# Altium schematic sheet Main Loom Schematic.SchDoc: MAIN LOOM
size A1; CheckedBy: TIMOTHY WARNOCK; Author: TIMOTHY WARNOCK; CompanyName: CURTIN MOTORSPORT TEAM; DrawnBy: TIMOTHY WARNOCK; Engineer: TIMOTHY WARNOCK; Revision: 2; SheetNumber: 1; SheetTotal: 5; PageSetup: Record=PageOptions|CenterHorizontal=True|CenterVertical=True|PrintScale=1.00|XCorrection=1.00|YCorrection=1.00|PrintKind=1|BorderSize=5000000|LeftOffset=0|BottomOffset=0|Orientation=2|PaperLength=1000|PaperWidth=1000|Scale=100|PaperSource=7|PrintQuality=-3|MediaType=1|DitherType=10|PrintScaleMode=1|PaperKind=A3|PaperIndex=8; ProjectName: 2017 PERMANENT LOOM
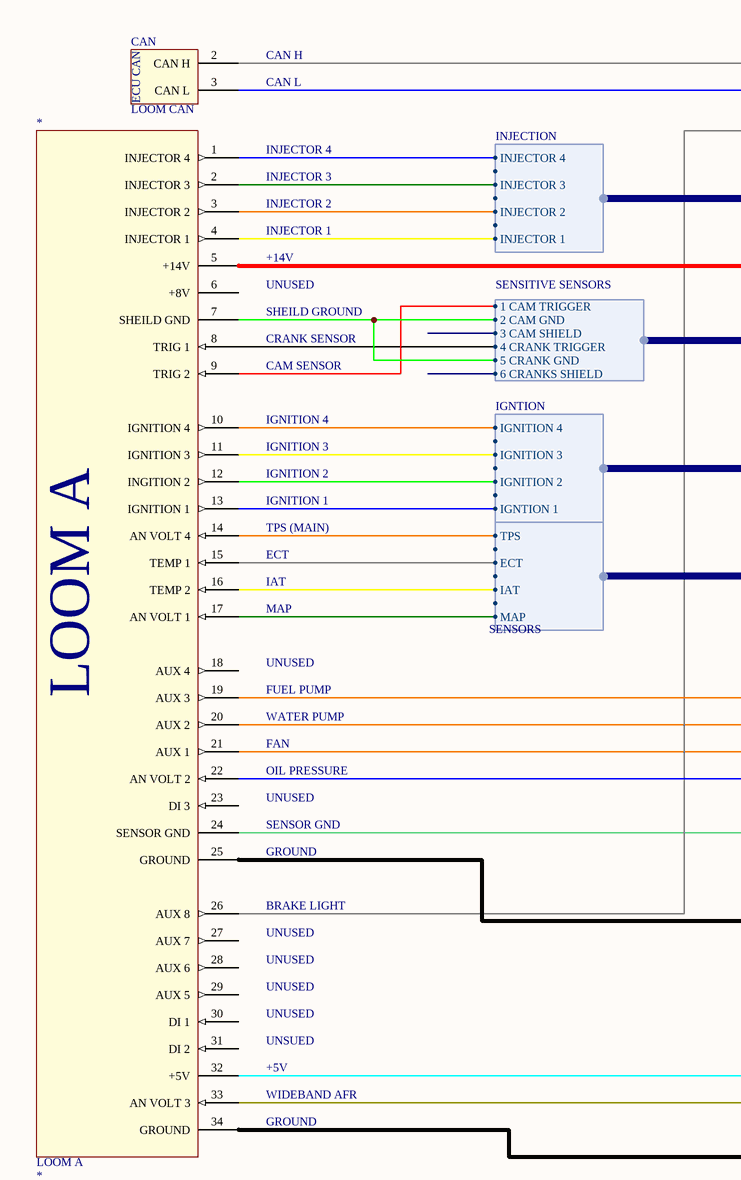
[diagram p0: Main Loom Schematic.SchDoc, top left]
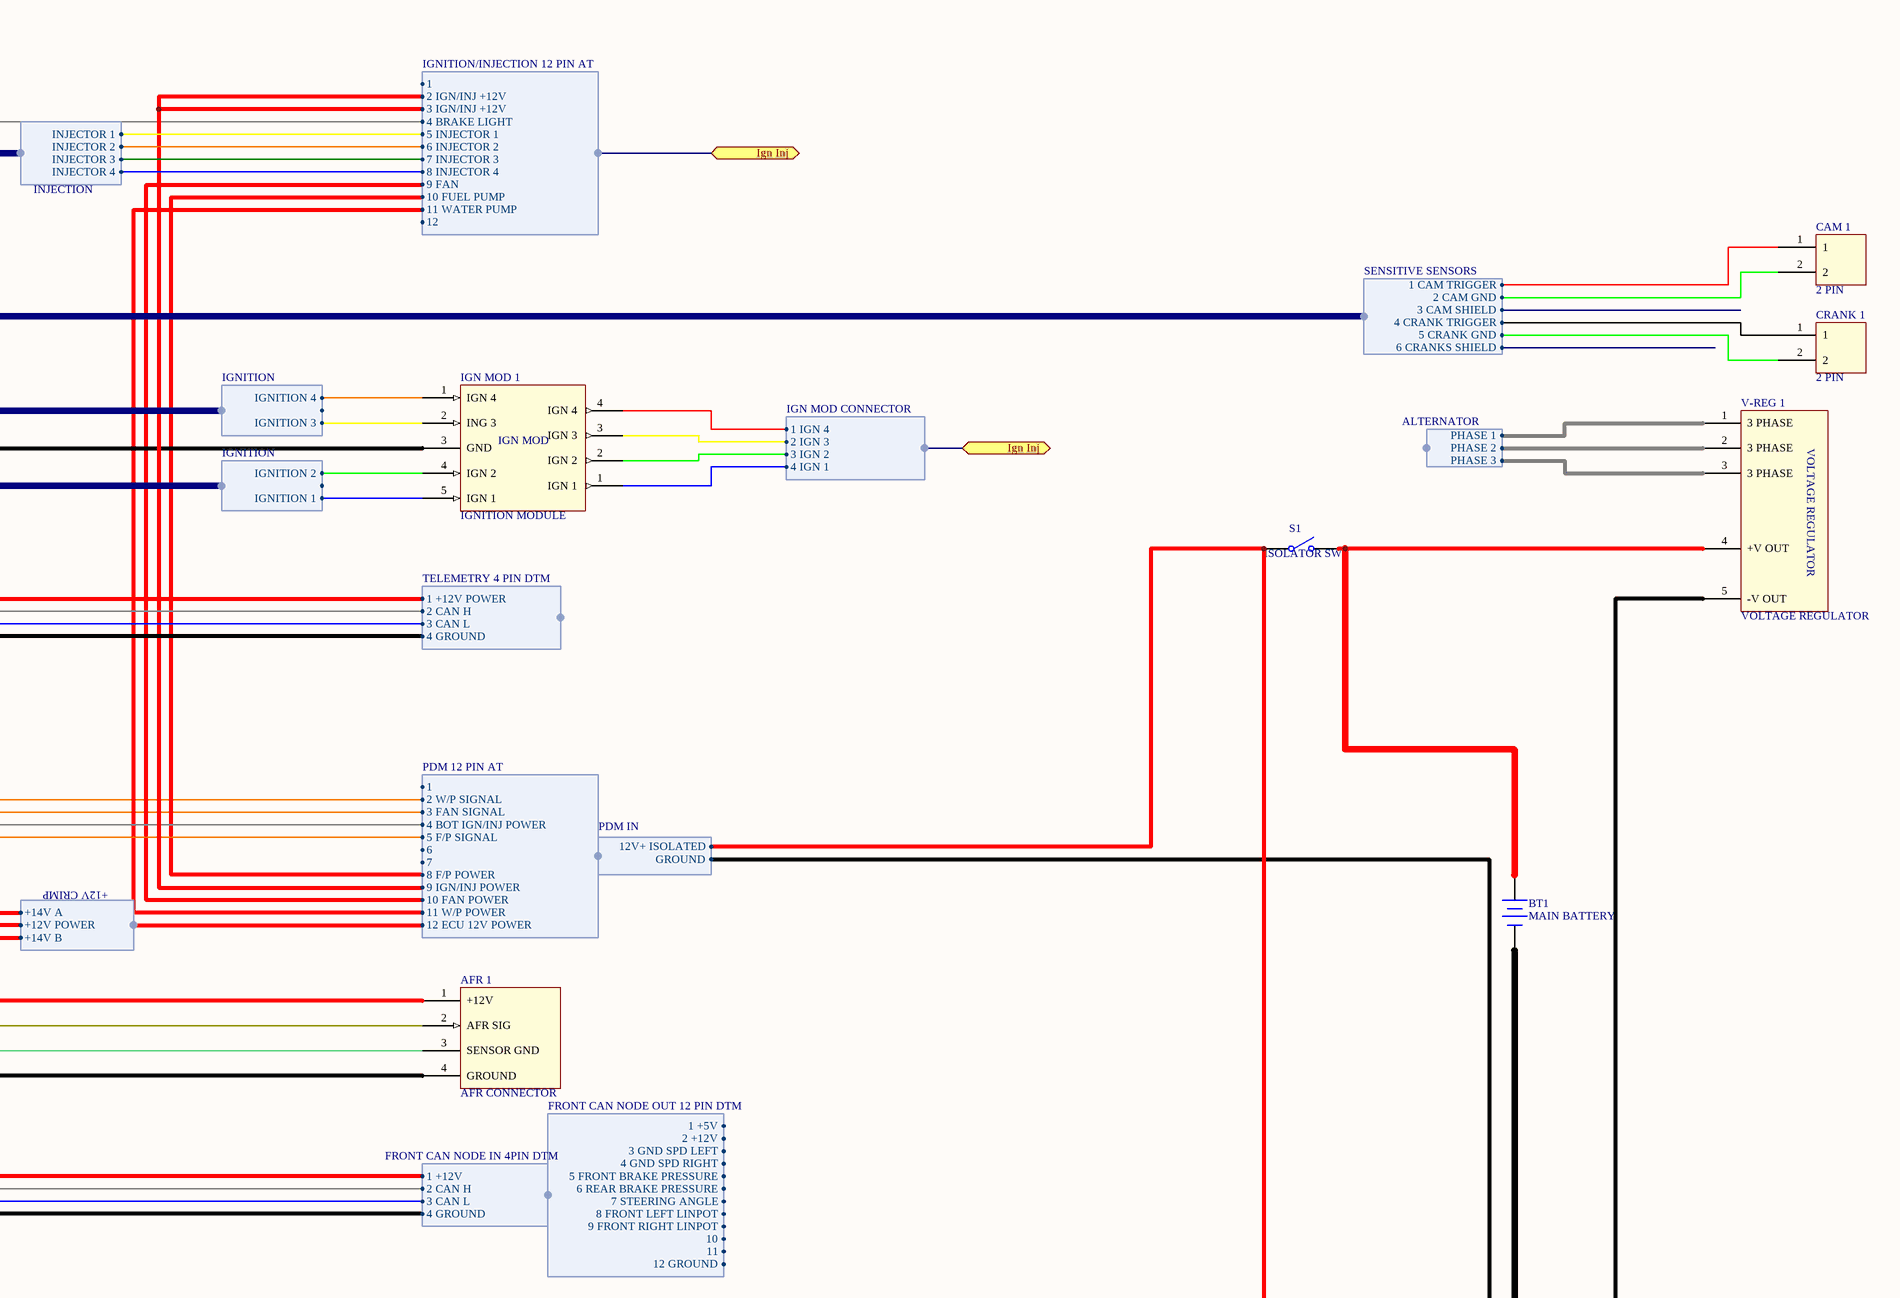
[diagram p1: Main Loom Schematic.SchDoc, top right]
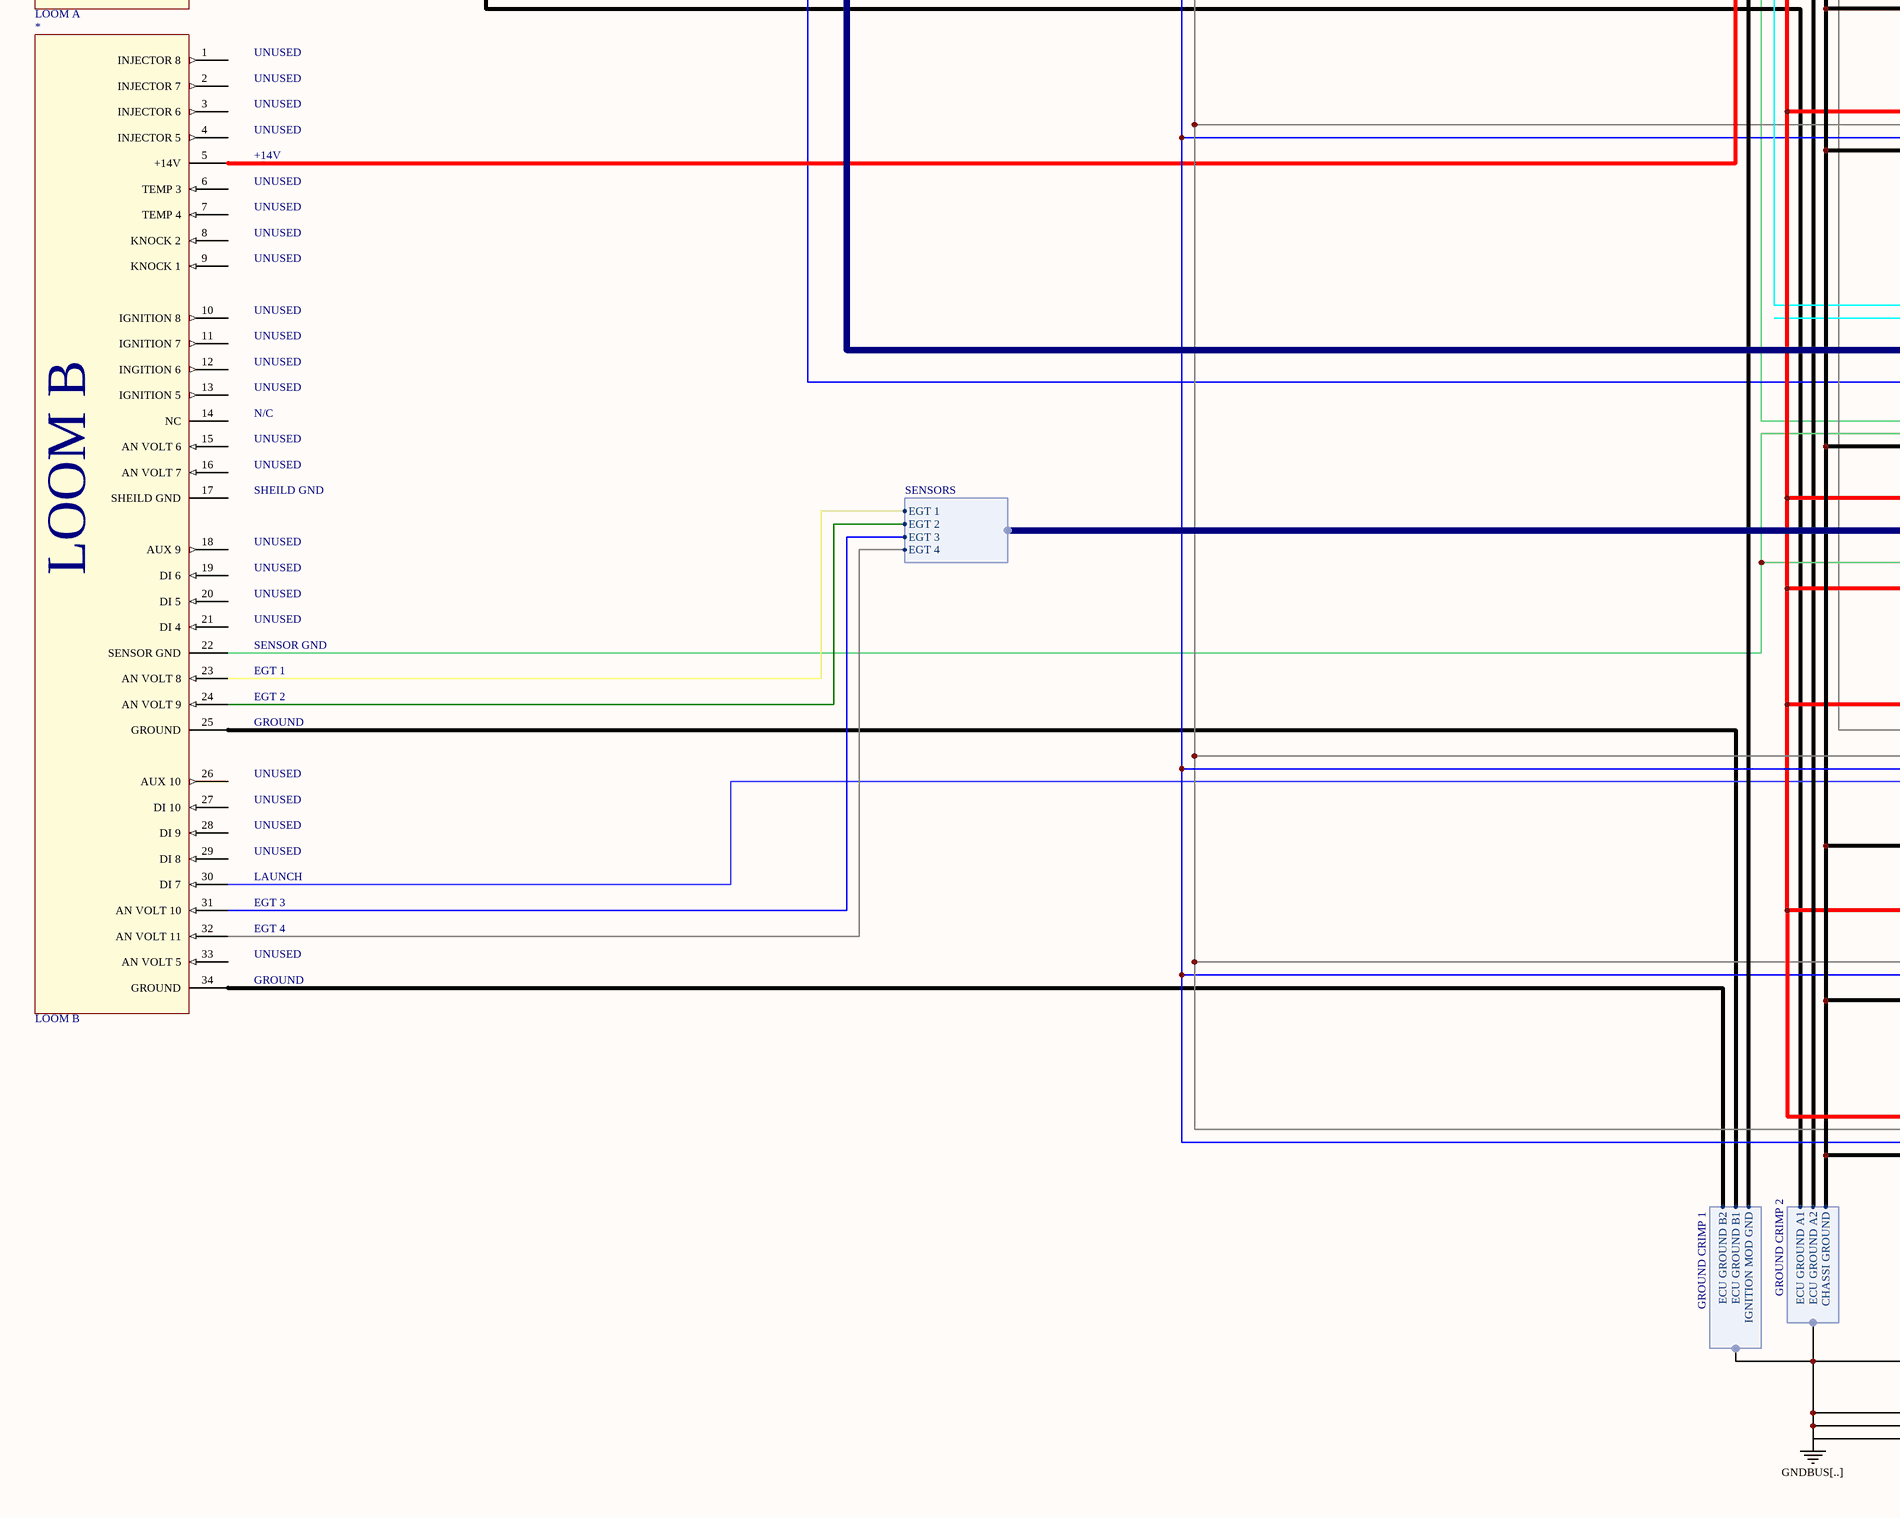
[diagram p2: Main Loom Schematic.SchDoc, bottom left]
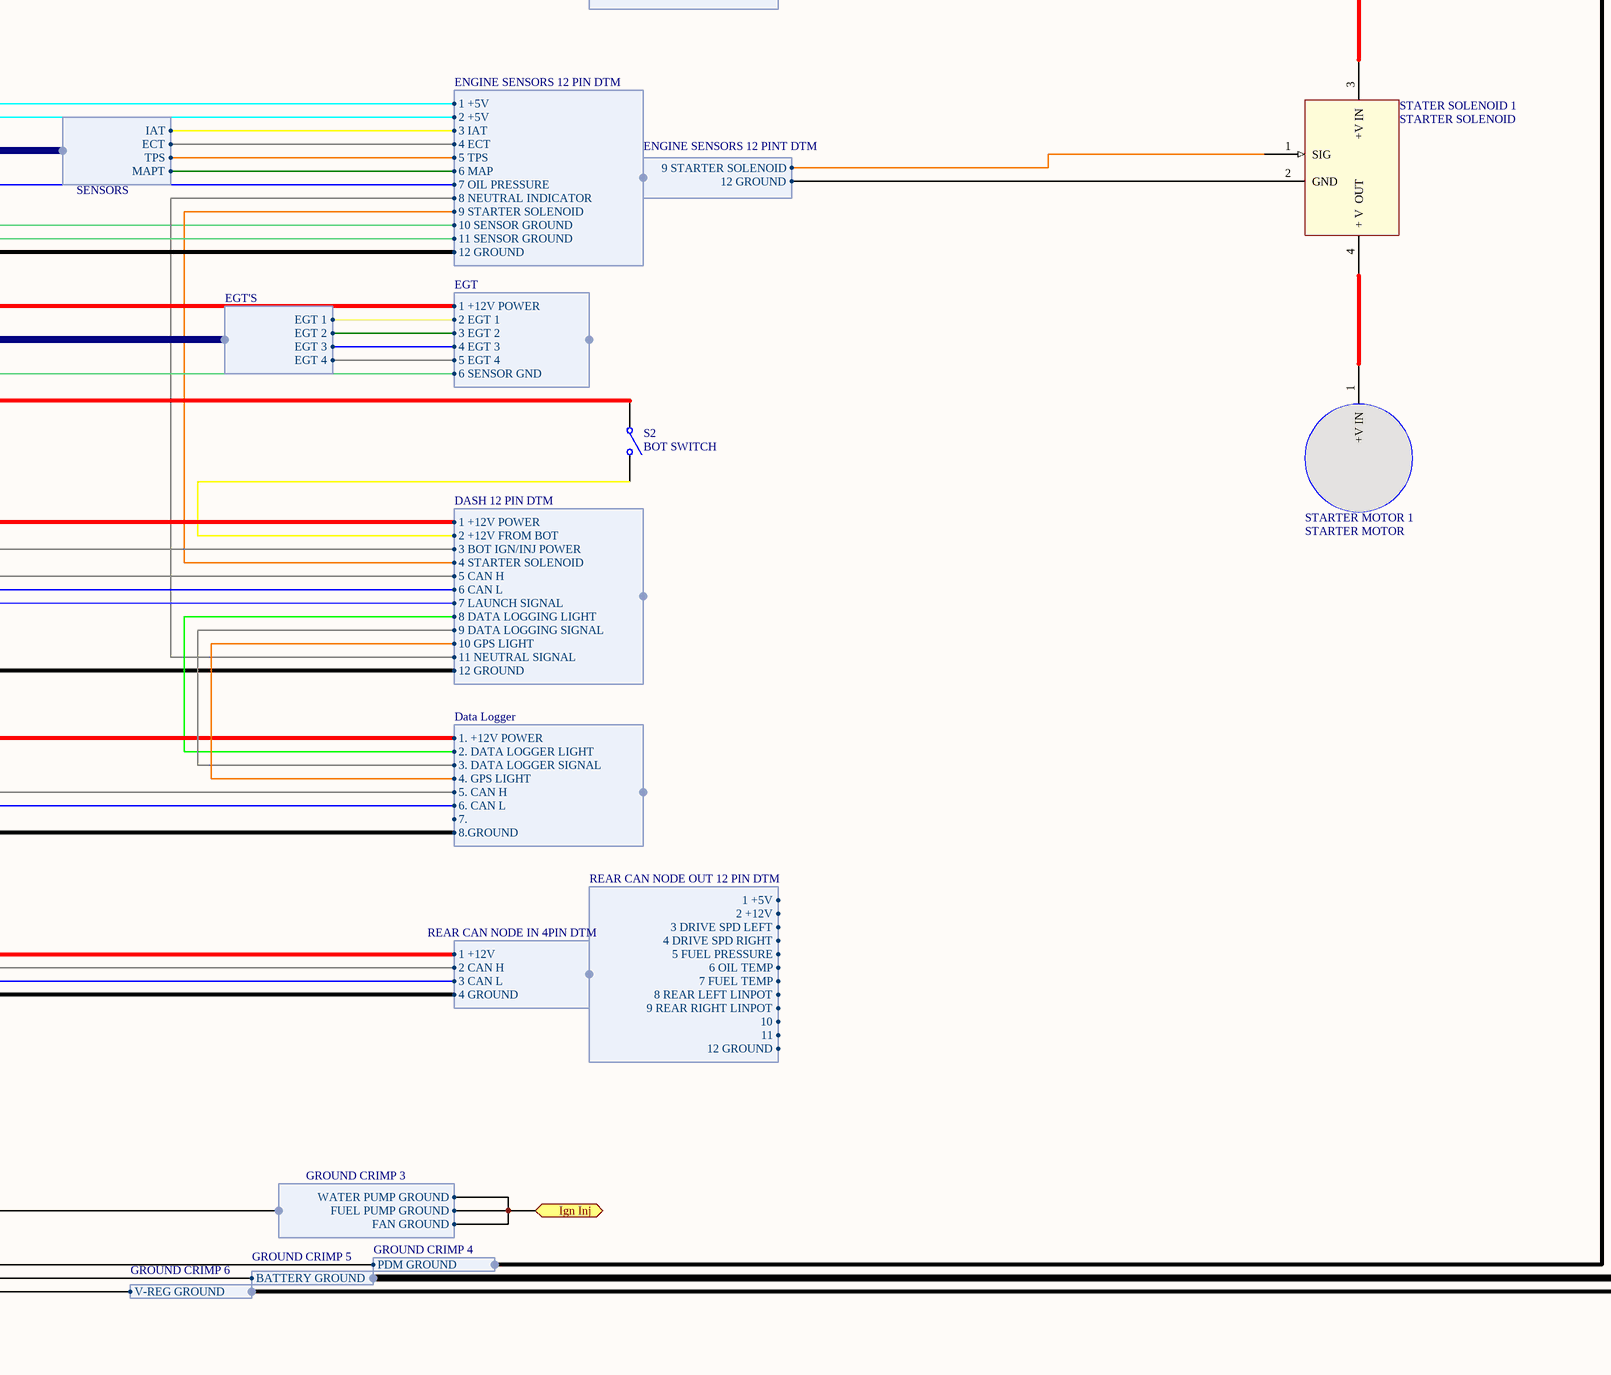
[diagram p3: Main Loom Schematic.SchDoc, bottom right]

## Parts
(Parts that share a designator on the sheet are numbered #1, #2 ... from top to bottom, then left to right.)
*#1  LOOM A
*#2  LOOM B
AFR_1  AFR CONNECTOR
BT1  MAIN BATTERY  [BAT-2]
CAM_1  2 PIN
CAN  LOOM CAN
CRANK_1  2 PIN
IGN_MOD_1  IGNITION MODULE
S1  ISOLATOR SW  [SPST-2]
S2  BOT SWITCH  [SPST-2]
STARTER_MOTOR_1  STARTER MOTOR
STATER_SOLENOID_1  STARTER SOLENOID
V-REG_1  VOLTAGE REGULATOR

## Ports
Ign Inj

## Harnesses
DASH 12 PIN DTM: 1 +12V POWER, 2 +12V FROM BOT, 3 BOT IGN/INJ POWER, 4 STARTER SOLENOID, 5 CAN H, 6 CAN L, 7 LAUNCH SIGNAL, 8 DATA LOGGING LIGHT, 9 DATA LOGGING SIGNAL, 10 GPS LIGHT, 11 NEUTRAL SIGNAL, 12 GROUND
PDM 12 PIN AT: 1, 2 W/P SIGNAL, 3 FAN SIGNAL, 4 BOT IGN/INJ POWER, 5 F/P SIGNAL, 6, 7, 8 F/P POWER, 9 IGN/INJ POWER, 10 FAN POWER, 11 W/P POWER, 12 ECU 12V POWER
ENGINE SENSORS 12 PIN DTM: 1 +5V, 2 +5V, 3 IAT, 4 ECT, 5 TPS, 6 MAP, 7 OIL PRESSURE, 8 NEUTRAL INDICATOR, 9 STARTER SOLENOID, 10 SENSOR GROUND, 11 SENSOR GROUND, 12 GROUND
IGNITION/INJECTION 12 PIN AT: 1, 2 IGN/INJ +12V, 3 IGN/INJ +12V, 4 BRAKE LIGHT, 5 INJECTOR 1, 6 INJECTOR 2, 7 INJECTOR 3, 8 INJECTOR 4, 9 FAN, 10 FUEL PUMP, 11 WATER PUMP, 12
GROUND CRIMP 2: ECU GROUND A1, ECU GROUND A2, CHASSI GROUND
GROUND CRIMP 1: ECU GROUND B2, ECU GROUND B1, IGNITION MOD GND
Data Logger: 1. +12V POWER, 2. DATA LOGGER LIGHT, 3. DATA LOGGER SIGNAL, 4. GPS LIGHT, 5. CAN H, 6. CAN L, 7., 8.GROUND
IGN MOD CONNECTOR: 1 IGN 4, 2 IGN 3, 3 IGN 2, 4 IGN 1
EGT: 1 +12V POWER, 2 EGT 1, 3 EGT 2, 4 EGT 3, 5 EGT 4, 6 SENSOR GND
GROUND CRIMP 3: WATER PUMP GROUND, FUEL PUMP GROUND, FAN GROUND
PDM IN: 12V+ ISOLATED, GROUND
GROUND CRIMP 4: PDM GROUND
GROUND CRIMP 5: BATTERY GROUND
GROUND CRIMP 6: V-REG GROUND
ALTERNATOR: PHASE 1, PHASE 2, PHASE 3
FRONT CAN NODE OUT 12 PIN DTM: 1 +5V, 2 +12V, 3 GND SPD LEFT, 4 GND SPD RIGHT, 5 FRONT BRAKE PRESSURE, 6 REAR BRAKE PRESSURE, 7 STEERING ANGLE, 8 FRONT LEFT LINPOT, 9 FRONT RIGHT LINPOT, 10, 11, 12 GROUND
FRONT CAN NODE IN 4PIN DTM: 1 +12V, 2 CAN H, 3 CAN L, 4 GROUND
REAR CAN NODE OUT 12 PIN DTM: 1 +5V, 2 +12V, 3 DRIVE SPD LEFT, 4 DRIVE SPD RIGHT, 5 FUEL PRESSURE, 6 OIL TEMP, 7 FUEL TEMP, 8 REAR LEFT LINPOT, 9 REAR RIGHT LINPOT, 10, 11, 12 GROUND
REAR CAN NODE IN 4PIN DTM: 1 +12V, 2 CAN H, 3 CAN L, 4 GROUND
SENSITIVE SENSORS: 1 CAM TRIGGER, 2 CAM GND, 3 CAM SHIELD, 4 CRANK TRIGGER, 5 CRANK GND, 6 CRANKS SHIELD
ENGINE SENSORS 12 PINT DTM: 9 STARTER SOLENOID, 12 GROUND
TELEMETRY 4 PIN DTM: 1 +12V POWER, 2 CAN H, 3 CAN L, 4 GROUND
+12V CRIMP: +14V B, +12V POWER, +14V A
INJECTION: INJECTOR 4, , INJECTOR 3, , INJECTOR 2, , INJECTOR 1
INJECTION: INJECTOR 1, INJECTOR 2, INJECTOR 3, INJECTOR 4
IGNTION: IGNITION 4, , IGNITION 3, , IGNITION 2, , IGNTION 1
IGNITION: IGNITION 4, , IGNITION 3
IGNITION: IGNITION 2, , IGNITION 1
SENSORS: TPS, , ECT, , IAT, , MAP
SENSORS: IAT, ECT, TPS, MAPT
SENSORS: EGT 1, EGT 2, EGT 3, EGT 4
EGT'S: EGT 1, EGT 2, EGT 3, EGT 4

## Nets
GNDBUS[..]: harness GROUND CRIMP 4.PDM GROUND, harness GROUND CRIMP 5.BATTERY GROUND, harness GROUND CRIMP 6.V-REG GROUND
Ign Inj: port Ign Inj, harness GROUND CRIMP 3.WATER PUMP GROUND, harness GROUND CRIMP 3.FUEL PUMP GROUND, harness GROUND CRIMP 3.FAN GROUND
Net*#1_1: *#1.1(INJECTOR_4) ; harness INJECTION.INJECTOR 4
Net*#1_2: *#1.2(INJECTOR_3) ; harness INJECTION.INJECTOR 3
Net*#1_3: *#1.3(INJECTOR_2) ; harness INJECTION.INJECTOR 2
Net*#1_4: *#1.4(INJECTOR_1) ; harness INJECTION.INJECTOR 1
Net*#1_5: *#1.5(+14V) ; harness +12V CRIMP.+14V A
Net*#1_7: *#1.7(SHEILD_GND) ; harness SENSITIVE SENSORS.2 CAM GND, harness SENSITIVE SENSORS.5 CRANK GND
Net*#1_8: *#1.8(TRIG_1) ; harness SENSITIVE SENSORS.4 CRANK TRIGGER
Net*#1_9: *#1.9(TRIG_2) ; harness SENSITIVE SENSORS.1 CAM TRIGGER
Net*#1_10: *#1.10(IGNITION_4) ; harness IGNTION.IGNITION 4
Net*#1_11: *#1.11(IGNITION_3) ; harness IGNTION.IGNITION 3
Net*#1_12: *#1.12(INGITION_2) ; harness IGNTION.IGNITION 2
Net*#1_13: *#1.13(IGNITION_1) ; harness IGNTION.IGNTION 1
Net*#1_14: *#1.14(AN_VOLT_4) ; harness SENSORS.TPS
Net*#1_15: *#1.15(TEMP_1) ; harness SENSORS.ECT
Net*#1_16: *#1.16(TEMP_2) ; harness SENSORS.IAT
Net*#1_17: *#1.17(AN_VOLT_1) ; harness SENSORS.MAP
Net*#1_19: *#1.19(AUX_3) ; harness PDM 12 PIN AT.5 F/P SIGNAL
Net*#1_20: *#1.20(AUX_2) ; harness PDM 12 PIN AT.2 W/P SIGNAL
Net*#1_21: *#1.21(AUX_1) ; harness PDM 12 PIN AT.3 FAN SIGNAL
Net*#1_22: *#1.22(AN_VOLT_2) ; harness ENGINE SENSORS 12 PIN DTM.7 OIL PRESSURE
Net*#1_24: *#1.24(SENSOR_GND) AFR_1.3(SENSOR_GND) ; harness ENGINE SENSORS 12 PIN DTM.10 SENSOR GROUND
Net*#1_25: *#1.25(GROUND) ; harness GROUND CRIMP 2.ECU GROUND A2
Net*#1_26: *#1.26(AUX_8) ; harness IGNITION/INJECTION 12 PIN AT.4 BRAKE LIGHT
Net*#1_32: *#1.32(+5V) ; harness ENGINE SENSORS 12 PIN DTM.1 +5V
Net*#1_33: *#1.33(AN_VOLT_3) AFR_1.2(AFR_SIG)
Net*#1_34: *#1.34(GROUND) ; harness GROUND CRIMP 2.ECU GROUND A1
Net*#2_5: *#2.5(+14V) ; harness +12V CRIMP.+14V B
Net*#2_22: *#2.22(SENSOR_GND) ; harness ENGINE SENSORS 12 PIN DTM.11 SENSOR GROUND, harness EGT.6 SENSOR GND
Net*#2_23: *#2.23(AN_VOLT_8) ; harness SENSORS.EGT 1
Net*#2_24: *#2.24(AN_VOLT_9) ; harness SENSORS.EGT 2
Net*#2_25: *#2.25(GROUND) ; harness GROUND CRIMP 1.ECU GROUND B1
Net*#2_30: *#2.30(DI_7) ; harness DASH 12 PIN DTM.7 LAUNCH SIGNAL
Net*#2_31: *#2.31(AN_VOLT_10) ; harness SENSORS.EGT 3
Net*#2_32: *#2.32(AN_VOLT_11) ; harness SENSORS.EGT 4
Net*#2_34: *#2.34(GROUND) ; harness GROUND CRIMP 1.ECU GROUND B2
NetAFR_1_1: AFR_1.1(+12V) S2.1(COMMON) ; harness DASH 12 PIN DTM.1 +12V POWER, harness Data Logger.1. +12V POWER, harness EGT.1 +12V POWER, harness FRONT CAN NODE IN 4PIN DTM.1 +12V, harness REAR CAN NODE IN 4PIN DTM.1 +12V, harness TELEMETRY 4 PIN DTM.1 +12V POWER, harness +12V CRIMP.+12V POWER
NetAFR_1_4: AFR_1.4(GROUND) STATER_SOLENOID_1.2(GND) ; harness DASH 12 PIN DTM.12 GROUND, harness ENGINE SENSORS 12 PIN DTM.12 GROUND, harness GROUND CRIMP 2.CHASSI GROUND, harness Data Logger.8.GROUND, harness FRONT CAN NODE IN 4PIN DTM.4 GROUND, harness REAR CAN NODE IN 4PIN DTM.4 GROUND, harness ENGINE SENSORS 12 PINT DTM.12 GROUND, harness TELEMETRY 4 PIN DTM.4 GROUND
NetBT1_1: BT1.1(+) S1.2(NO) V-REG_1.4(+V_OUT)
NetCAM_1_1: CAM_1.1 ; harness SENSITIVE SENSORS.1 CAM TRIGGER
NetCAM_1_2: CAM_1.2 ; harness SENSITIVE SENSORS.2 CAM GND
NetCAN_2: CAN.2(CAN_H) ; harness DASH 12 PIN DTM.5 CAN H, harness Data Logger.5. CAN H, harness FRONT CAN NODE IN 4PIN DTM.2 CAN H, harness REAR CAN NODE IN 4PIN DTM.2 CAN H, harness TELEMETRY 4 PIN DTM.2 CAN H
NetCAN_3: CAN.3(CAN_L) ; harness DASH 12 PIN DTM.6 CAN L, harness Data Logger.6. CAN L, harness FRONT CAN NODE IN 4PIN DTM.3 CAN L, harness REAR CAN NODE IN 4PIN DTM.3 CAN L, harness TELEMETRY 4 PIN DTM.3 CAN L
NetCRANK_1_1: CRANK_1.1 ; harness SENSITIVE SENSORS.4 CRANK TRIGGER
NetCRANK_1_2: CRANK_1.2 ; harness SENSITIVE SENSORS.5 CRANK GND
NetIGN_MOD_1_1: IGN_MOD_1.1(IGN_4) ; harness IGNITION.IGNITION 4
NetIGN_MOD_1_1: IGN_MOD_1.1(IGN_1) ; harness IGN MOD CONNECTOR.4 IGN 1  [a separate net that carries the same name]
NetIGN_MOD_1_2: IGN_MOD_1.2(ING_3) ; harness IGNITION.IGNITION 3
NetIGN_MOD_1_2: IGN_MOD_1.2(IGN_2) ; harness IGN MOD CONNECTOR.3 IGN 2  [a separate net that carries the same name]
NetIGN_MOD_1_3: IGN_MOD_1.3(GND) ; harness GROUND CRIMP 1.IGNITION MOD GND
NetIGN_MOD_1_3: IGN_MOD_1.3(IGN_3) ; harness IGN MOD CONNECTOR.2 IGN 3  [a separate net that carries the same name]
NetIGN_MOD_1_4: IGN_MOD_1.4(IGN_2) ; harness IGNITION.IGNITION 2
NetIGN_MOD_1_4: IGN_MOD_1.4(IGN_4) ; harness IGN MOD CONNECTOR.1 IGN 4  [a separate net that carries the same name]
NetIGN_MOD_1_5: IGN_MOD_1.5(IGN_1) ; harness IGNITION.IGNITION 1
NetS1_1: S1.1(COMMON) STATER_SOLENOID_1.3(+V_IN) ; harness PDM IN.12V+ ISOLATED
NetS2_2: S2.2(NO) ; harness DASH 12 PIN DTM.2 +12V FROM BOT
NetSTARTER_MOTOR_1_1: STARTER_MOTOR_1.1(+V_IN) STATER_SOLENOID_1.4(+_V__OUT)
NetSTATER_SOLENOID_1_1: STATER_SOLENOID_1.1(SIG) ; harness DASH 12 PIN DTM.4 STARTER SOLENOID, harness ENGINE SENSORS 12 PIN DTM.9 STARTER SOLENOID, harness ENGINE SENSORS 12 PINT DTM.9 STARTER SOLENOID
NetV-REG_1_1: V-REG_1.1(3_PHASE) ; harness ALTERNATOR.PHASE 1
NetV-REG_1_2: V-REG_1.2(3_PHASE) ; harness ALTERNATOR.PHASE 2
NetV-REG_1_3: V-REG_1.3(3_PHASE) ; harness ALTERNATOR.PHASE 3
(unnamed): harness DASH 12 PIN DTM.3 BOT IGN/INJ POWER, harness PDM 12 PIN AT.4 BOT IGN/INJ POWER
(unnamed): harness DASH 12 PIN DTM.8 DATA LOGGING LIGHT, harness Data Logger.2. DATA LOGGER LIGHT
(unnamed): harness DASH 12 PIN DTM.9 DATA LOGGING SIGNAL, harness Data Logger.3. DATA LOGGER SIGNAL
(unnamed): harness DASH 12 PIN DTM.10 GPS LIGHT, harness Data Logger.4. GPS LIGHT
(unnamed): harness DASH 12 PIN DTM.11 NEUTRAL SIGNAL, harness ENGINE SENSORS 12 PIN DTM.8 NEUTRAL INDICATOR
(unnamed): harness PDM 12 PIN AT.8 F/P POWER, harness IGNITION/INJECTION 12 PIN AT.10 FUEL PUMP
(unnamed): harness PDM 12 PIN AT.9 IGN/INJ POWER, harness IGNITION/INJECTION 12 PIN AT.2 IGN/INJ +12V, harness IGNITION/INJECTION 12 PIN AT.3 IGN/INJ +12V
(unnamed): harness PDM 12 PIN AT.10 FAN POWER, harness IGNITION/INJECTION 12 PIN AT.9 FAN
(unnamed): harness PDM 12 PIN AT.11 W/P POWER, harness IGNITION/INJECTION 12 PIN AT.11 WATER PUMP
(unnamed): harness ENGINE SENSORS 12 PIN DTM.3 IAT, harness SENSORS.IAT
(unnamed): harness ENGINE SENSORS 12 PIN DTM.4 ECT, harness SENSORS.ECT
(unnamed): harness ENGINE SENSORS 12 PIN DTM.5 TPS, harness SENSORS.TPS
(unnamed): harness ENGINE SENSORS 12 PIN DTM.6 MAP, harness SENSORS.MAPT
(unnamed): harness IGNITION/INJECTION 12 PIN AT.5 INJECTOR 1, harness INJECTION.INJECTOR 1
(unnamed): harness IGNITION/INJECTION 12 PIN AT.6 INJECTOR 2, harness INJECTION.INJECTOR 2
(unnamed): harness IGNITION/INJECTION 12 PIN AT.7 INJECTOR 3, harness INJECTION.INJECTOR 3
(unnamed): harness IGNITION/INJECTION 12 PIN AT.8 INJECTOR 4, harness INJECTION.INJECTOR 4
(unnamed): harness EGT.2 EGT 1, harness EGT'S.EGT 1
(unnamed): harness EGT.3 EGT 2, harness EGT'S.EGT 2
(unnamed): harness EGT.4 EGT 3, harness EGT'S.EGT 3
(unnamed): harness EGT.5 EGT 4, harness EGT'S.EGT 4

Not connected (* = marked no-connect by the designer): *#1 6(+8V) 18(AUX_4) 23(DI_3) 27(AUX_7) 28(AUX_6) 29(AUX_5) 30(DI_1) 31(DI_2); *#2 1(INJECTOR_8) 2(INJECTOR_7) 3(INJECTOR_6) 4(INJECTOR_5) 6(TEMP_3) 7(TEMP_4) 8(KNOCK_2) 9(KNOCK_1) 10(IGNITION_8) 11(IGNITION_7) 12(INGITION_6) 13(IGNITION_5) 14(NC) 15(AN_VOLT_6) 16(AN_VOLT_7) 17(SHEILD_GND) 18(AUX_9) 19(DI_6) 20(DI_5) 21(DI_4) 26(AUX_10) 27(DI_10) 28(DI_9) 29(DI_8) 33(AN_VOLT_5); BT1 2(-); V-REG_1 5(-V_OUT)

## Notes on the sheet
- CAN H
- CAN L
- INJECTOR 4
- INJECTOR 3
- INJECTOR 2
- INJECTOR 1
- +14V
- UNUSED
- SHEILD GROUND
- CRANK SENSOR
- CAM SENSOR
- IGNITION 4
- IGNITION 3
- IGNITION 2
- IGNITION 1
- TPS (MAIN)
- ECT
- IAT
- MAP
- FUEL PUMP
- WATER PUMP
- FAN
- OIL PRESSURE
- SENSOR GND
- GROUND
- BRAKE LIGHT
- UNSUED
- +5V
- WIDEBAND AFR
- N/C
- SHEILD GND
- EGT 1
- EGT 2
- LAUNCH
- EGT 3
- EGT 4
- Title
- Size:
- Date:
- File:
- A1
- Number:
- Time:
- Revision:
- Sheet
- of
- (in symbol IGNITION MODULE) IGN MOD
- (in symbol LOOM CAN) ECU CAN

## Library data of the parts
*#1 = LOOM A: 34 pin ECU connector
*#2 = LOOM B: 34 pin ECU connector
BT1 = Battery: Multicell Battery; Published: 24-Mar-1999; LatestRevisionDate: 17-Jul-2002; LatestRevisionNote: Re-released for DXP Platform.; PackageReference: BAT-2; Publisher: Altium Limited; PackageDescription: Battery; 2 Leads
IGN_MOD_1 = IGNITION MODULE: BOSCH 4 PIN IGNITION MODULE 227 100 211
S1 S2 = SW-SPST: Single-Pole, Single-Throw Switch; Published: 24-Mar-1999; LatestRevisionDate: 17-Jul-2002; LatestRevisionNote: Re-released for DXP Platform.; PackageReference: SPST-2; Publisher: Altium Limited; PackageDescription: Switch; 2 Leads
STARTER_MOTOR_1 = STARTER MOTOR: CBR600 STARTER MOTOR
V-REG_1 = VOLTAGE REGULATOR: SHINDENGEN F FH012AA